# Altium project esp32WifiDeauther.PrjPcb
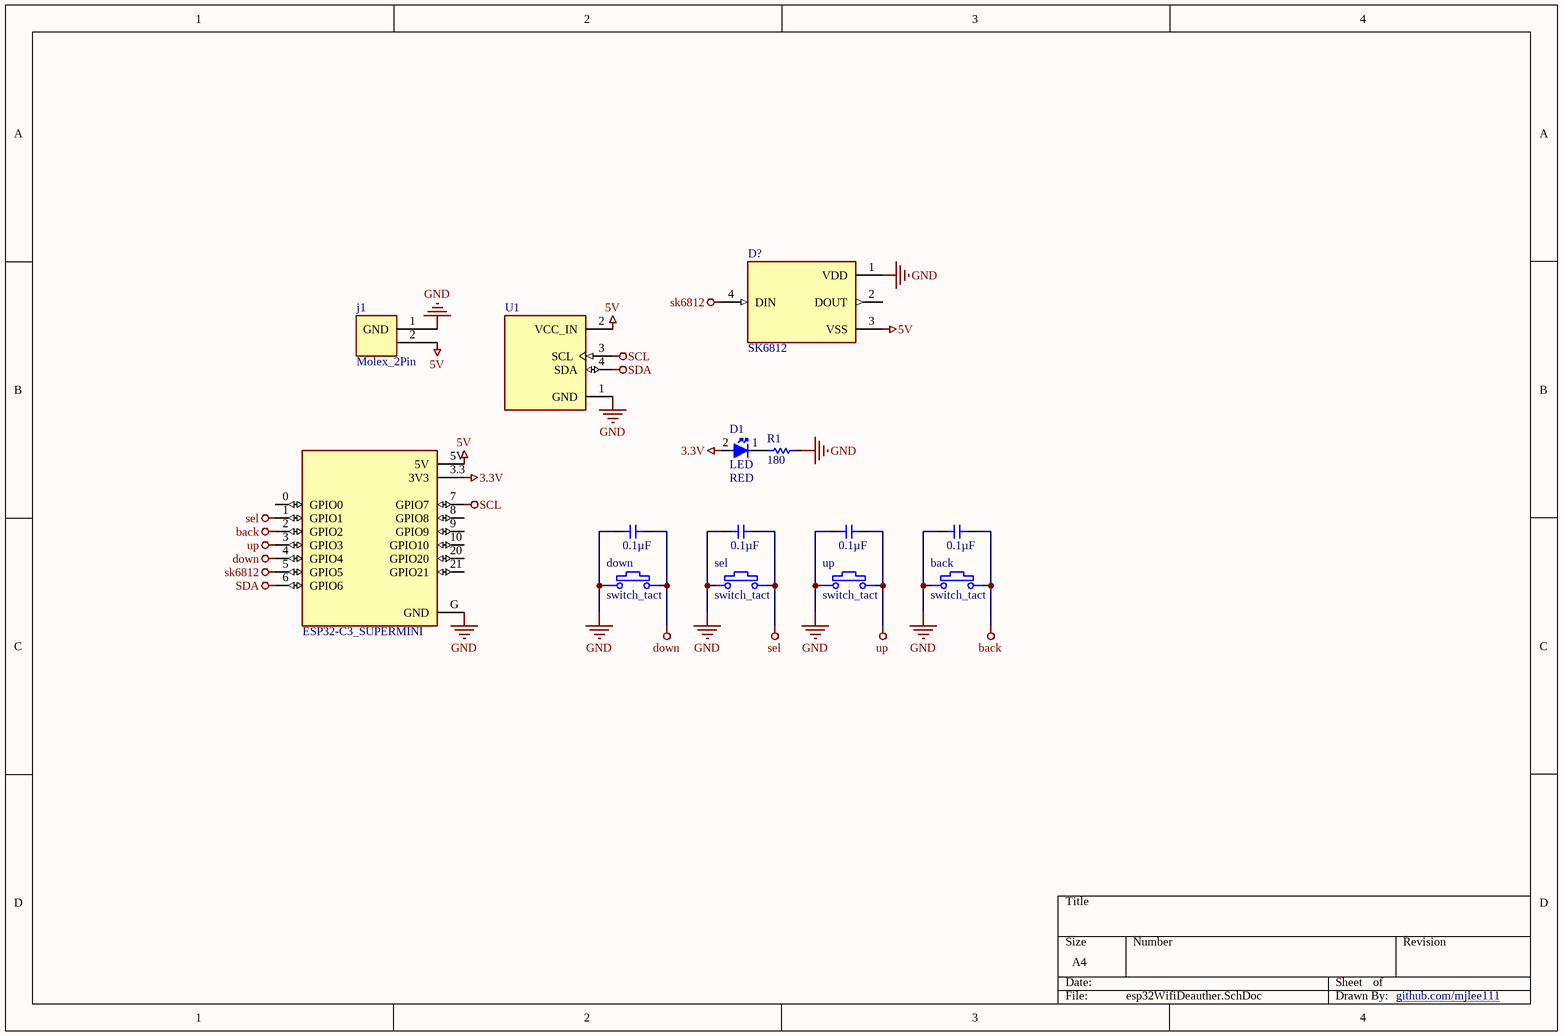
[diagram p0: esp32WifiDeauther.SchDoc]
1 sheet, 14 parts. Net scope: global (net labels, ports and power ports of the same name join across sheets).
Board file: esp32WifiDeauther.PcbDoc

## Sheet esp32WifiDeauther.SchDoc
size A4; SheetNumber: 1; SheetTotal: 1

### Parts
back  switch_tact  [SMD_PUSH_SW]
c_back  Capacitance: 0.1µF  [SMD_Capacitor]  (hidden comment: non-polar_Capacitor)
c_down  Capacitance: 0.1µF  [SMD_Capacitor]  (hidden comment: non-polar_Capacitor)
c_sel  Capacitance: 0.1µF  [SMD_Capacitor]  (hidden comment: non-polar_Capacitor)
c_up  Capacitance: 0.1µF  [SMD_Capacitor]  (hidden comment: non-polar_Capacitor)
D1  LED  Color: RED  [SMD_LED]
D?  SK6812  [LED_SK6812]
down  switch_tact  [SMD_PUSH_SW]
esp32-C3-Super-Mini  ESP32-C3_SUPERMINI  [MODULE_ESP32-C3_SUPERMINI]
j1  Molex_2Pin  [MOLEX_2PIN]
R1  Resistance: 180  [SMD_Resistor]  (hidden comment: Resistor)
sel  switch_tact  [SMD_PUSH_SW]
U1  DM-OLED096-636  [MODULE_DM-OLED096-636]  (value not drawn)
up  switch_tact  [SMD_PUSH_SW]

### Nets
3.3V: D1.2 esp32-C3-Super-Mini.3.3(3V3)
5V: D?.3(VSS) esp32-C3-Super-Mini.5V j1.2 U1.2(VCC_IN)
back: back.2 c_back.2 esp32-C3-Super-Mini.2(GPIO2)
down: c_down.2 down.2 esp32-C3-Super-Mini.4(GPIO4)
GND: back.1 c_back.1 c_down.1 c_sel.1 c_up.1 D?.1(VDD) down.1 esp32-C3-Super-Mini.G(GND) j1.1(GND) R1.2 sel.1 U1.1(GND) up.1
SCL: esp32-C3-Super-Mini.7(GPIO7) U1.3(SCL)
SDA: esp32-C3-Super-Mini.6(GPIO6) U1.4(SDA)
sel: c_sel.2 esp32-C3-Super-Mini.1(GPIO1) sel.2
sk6812: D?.4(DIN) esp32-C3-Super-Mini.5(GPIO5)
up: c_up.2 esp32-C3-Super-Mini.3(GPIO3) up.2
NetD1_1: D1.1 R1.1

Not connected (* = marked no-connect by the designer): D? 2(DOUT); esp32-C3-Super-Mini 0(GPIO0) 8(GPIO8) 9(GPIO9) 10(GPIO10) 20(GPIO20) 21(GPIO21)

### Notes on the sheet
- github.com/mjlee111 <http://github.com/mjlee111>

### Library data of the parts
back down sel up = CMP-030-000003-1: micro tact switch; Design Item ID: switch_tact; Source: robit_switch.SchLib
c_back c_down c_sel c_up = CMP-024-000020-2: SMD type ceramic capacitor; Source: robit_passive.SchLib; Design Item ID: Capacitor
D1 = CMP-026-000008-1: Light Emitting Diode; Design Item ID: LED; Source: robit_passive.SchLib
D? = CMP-026-000014-1: SMD 5050 Full color RGB LED data transmission frequency up to 800Kbps, with 30 fps refresh rate, 5.00x5.00 mm; MF: Shenzhen LED Color Optoelectronic Inc.; Design Item ID: SK6812; SnapEDA_Link: https://www.snapeda.com/parts/SK6812/Shenzhen%20LED%20Color%20Optoelectronic%20Inc./view-part/554016/?ref=snap; Source: SK6812.SchLib; Price: None; Availability: Unavailable; Check_prices: https://www.snapeda.com/parts/SK6812/Shenzhen%20LED%20Color%20Optoelectronic%20Inc./view-part/554016/?ref=eda; Pin Count: 4; Package: SMD-4 Shenzhen LED Color Optoelectronic Inc.; MP: SK6812; Value: *; Component Type: Standard
esp32-C3-Super-Mini = CMP-021-000014-1: Super tiny ESP32-C3 board; MP: ESP32-C3 SuperMini; MF: Espressif Systems; Check_prices: https://www.snapeda.com/parts/ESP32-C3%20SuperMini/Espressif+Systems/view-part/?ref=eda; Source: ESP32-C3_SUPERMINI.SchLib; Component Type: Standard; SnapEDA_Link: https://www.snapeda.com/parts/ESP32-C3%20SuperMini/Espressif+Systems/view-part/?ref=snap; Pin Count: 16; Package: Package; Value: *; Design Item ID: ESP32-C3_SUPERMINI
j1 = CMP-019-000043-1: Molex 2Pin Connector; Source: robit_connector.SchLib; Design Item ID: Molex_2Pin
R1 = CMP-029-000004-2: SMD type resistor; Source: robit_passive.SchLib; Design Item ID: Resistor
U1 = CMP-076-000001-1: 0.96??128 X 64 MONOCHROME GRAPHIC OLED DISPLAY MODULE - I2C; MP: DM-OLED096-636; Component Type: Standard; MF: Display Module; Package: Package; Check_prices: https://www.snapeda.com/parts/DM-OLED096-636/Display+Module/view-part/?ref=eda; Pin Count: 4; Value: *; Source: DM-OLED096-636.SchLib; SnapEDA_Link: https://www.snapeda.com/parts/DM-OLED096-636/Display+Module/view-part/?ref=snap; Design Item ID: DM-OLED096-636